# Altium schematic sheet ST_LINK.SchDoc
size A3; SheetNumber: 1; SheetTotal: 1
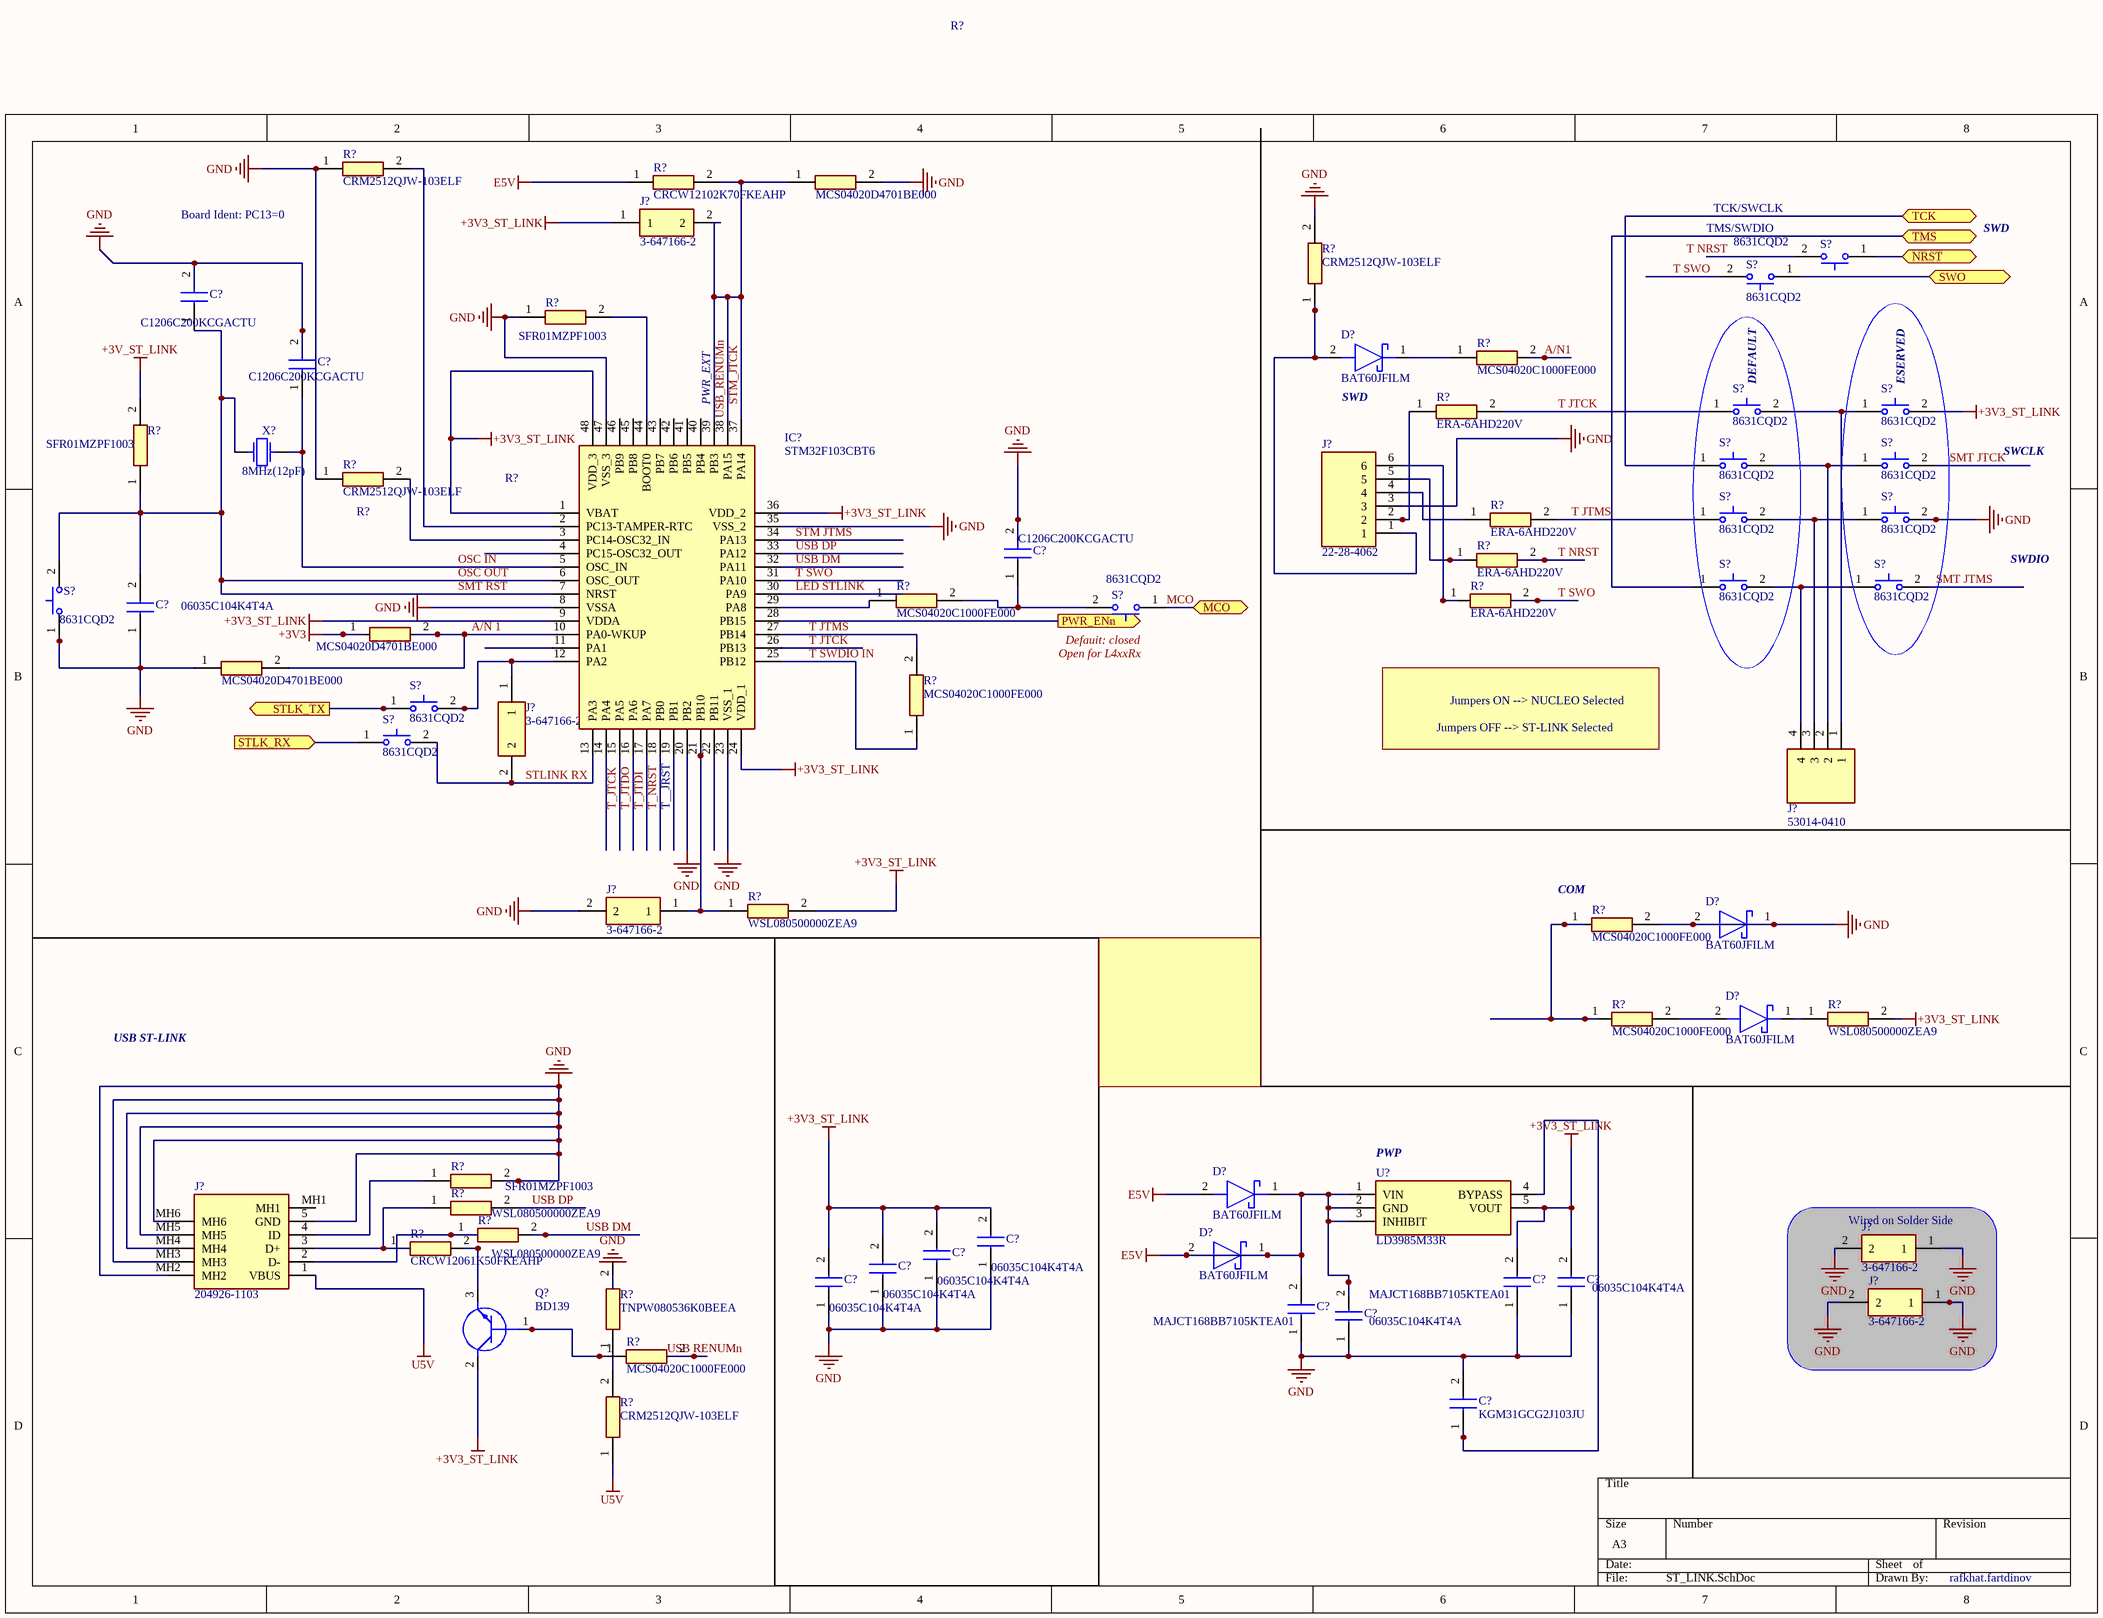
[diagram p0: ST_LINK.SchDoc]

## Parts
(Parts that share a designator on the sheet are numbered #1, #2 ... from top to bottom, then left to right.)
C?#1  C1206C200KCGACTU  [C1206]
C?#2  C1206C200KCGACTU  [C1206]
C?#3  C1206C200KCGACTU  [C1206]
C?#4  06035C104K4T4A  [CAPC1608X90N]
C?#5  06035C104K4T4A  [CAPC1608X90N]
C?#6  06035C104K4T4A  [CAPC1608X90N]
C?#7  06035C104K4T4A  [CAPC1608X90N]
C?#8  06035C104K4T4A  [CAPC1608X90N]
C?#9  MAJCT168BB7105KTEA01  [MAJx16]
C?#10  06035C104K4T4A  [CAPC1608X90N]
C?#11  MAJCT168BB7105KTEA01  [MAJx16]
C?#12  06035C104K4T4A  [CAPC1608X90N]
C?#13  KGM31GCG2J103JU  [CAPC3316X145N]
D?#1  BAT60JFILM  [SOD2513X117N]
D?#2  BAT60JFILM  [SOD2513X117N]
D?#3  BAT60JFILM  [SOD2513X117N]
D?#4  BAT60JFILM  [SOD2513X117N]
D?#5  BAT60JFILM  [SOD2513X117N]
IC?  STM32F103CBT6  [QFP50P900X900X160-48N]
J?#1  3-647166-2  [36471662]
J?#2  22-28-4062  [HDRV6W66P0X254_1X6_1524X249X838P]
J?#3  53014-0410  [SHDR4W60P0X200_1X4_1200X435X1000P]
J?#4  3-647166-2  [36471662]
J?#5  3-647166-2  [36471662]
J?#6  3-647166-2  [36471662]
J?#7  204926-1103  [2049261103]
J?#8  3-647166-2  [36471662]
Q?  BD139  [TO254P290X760X1320-3P]
R?#1  CRM2512QJW-103ELF  [RESC6331X80N]
R?#2  CRCW12102K70FKEAHP  [RESC3225X70N]
R?#3  MCS04020D4701BE000  [RESC1005X37N]
R?#4  CRM2512QJW-103ELF  [RESC6331X80N]
R?#5  SFR01MZPF1003  [RESC1005X40N]
R?#6  MCS04020C1000FE000  [RESC1005X37N]
R?#7  ERA-6AHD220V  [ERA6AEB1020V]
R?#8  CRM2512QJW-103ELF  [RESC6331X80N]
R?#9  SFR01MZPF1003  [RESC1005X40N]
R?#10  ERA-6AHD220V  [ERA6AEB1020V]
R?#11  ERA-6AHD220V  [ERA6AEB1020V]
R?#12  MCS04020C1000FE000  [RESC1005X37N]
R?#13  ERA-6AHD220V  [ERA6AEB1020V]
R?#14  MCS04020D4701BE000  [RESC1005X37N]
R?#15  MCS04020D4701BE000  [RESC1005X37N]
R?#16  MCS04020C1000FE000  [RESC1005X37N]
R?#17  WSL080500000ZEA9  [RESC2013X84N]
R?#18  MCS04020C1000FE000  [RESC1005X37N]
R?#19  MCS04020C1000FE000  [RESC1005X37N]
R?#20  WSL080500000ZEA9  [RESC2013X84N]
R?#21  SFR01MZPF1003  [RESC1005X40N]
R?#22  WSL080500000ZEA9  [RESC2013X84N]
R?#23  WSL080500000ZEA9  [RESC2013X84N]
R?#24  CRCW12061K50FKEAHP  [RESC3116X65N]
R?#25  MCS04020C1000FE000  [RESC1005X37N]
R?#26  TNPW080536K0BEEA  [RESC2012X55N]
R?#27  CRM2512QJW-103ELF  [RESC6331X80N]
S?#1  8631CQD2  [8631CQD2]
S?#2  8631CQD2  [8631CQD2]
S?#3  8631CQD2  [8631CQD2]
S?#4  8631CQD2  [8631CQD2]
S?#5  8631CQD2  [8631CQD2]
S?#6  8631CQD2  [8631CQD2]
S?#7  8631CQD2  [8631CQD2]
S?#8  8631CQD2  [8631CQD2]
S?#9  8631CQD2  [8631CQD2]
S?#10  8631CQD2  [8631CQD2]
S?#11  8631CQD2  [8631CQD2]
S?#12  8631CQD2  [8631CQD2]
S?#13  8631CQD2  [8631CQD2]
S?#14  8631CQD2  [8631CQD2]
U?  LD3985M33R  [SOT95P280X145-5N]
X?  F0: 8MHz(12pF)  (hidden comment: Crystal)

## Blocks framed on the sheet
Wired on Solder Side: J?#6 J?#8

## Ports
MCO (bidir), NRST (bidir), PWR_ENn (out), STLK_RX (in), STLK_TX (out), SWO (bidir), TCK (bidir), TMS (bidir)

## Nets
+3V3: R?#14.1
+3V3_ST_LINK: C?#5.2 C?#6.2 C?#7.2 C?#8.2 C?#9.2 C?#10.2 IC?.1(VBAT) IC?.9(VDDA) IC?.24(VDD_1) IC?.36(VDD_2) IC?.48(VDD_3) J?#1.1 Q?.2(C) R?#17.2 R?#20.2 S?#4.2(N.O._2) U?.5(VOUT)
+3V_ST_LINK: R?#9.2
E5V: C?#11.2 C?#12.2 D?#4.1(K) D?#4.2(A) D?#5.1(K) D?#5.2(A) R?#2.1 U?.1(VIN) U?.2(GND) U?.3(INHIBIT)
GND: C?#1.2 C?#2.2 C?#3.2 C?#4.1 C?#5.1 C?#6.1 C?#7.1 C?#8.1 C?#9.1 C?#10.1 C?#11.1 C?#12.1 C?#13.2 D?#2.1(K) D?#2.2(A) IC?.8(VSSA) IC?.20(PB2) IC?.23(VSS_1) IC?.35(VSS_2) IC?.47(VSS_3) J?#2.3 J?#5.2 J?#6.1 J?#6.2 J?#7.5(GND) J?#7.MH2 J?#7.MH3 J?#7.MH4 J?#7.MH5 J?#7.MH6 J?#8.1 J?#8.2 R?#1.1 R?#3.2 R?#4.2 R?#5.1 R?#8.1 R?#15.1 R?#18.2 R?#21.2 S?#8.2(N.O._2) S?#12.1(N.O._1)
U5V: J?#7.1(VBUS) R?#27.1
MCO: S?#11.1(N.O._1) ; port MCO
NRST: S?#1.1(N.O._1) ; port NRST
PWR_ENn: IC?.28(PB15) ; port PWR_ENn
STLK_RX: S?#14.1(N.O._1) ; port STLK_RX
STLK_TX: S?#13.1(N.O._1) ; port STLK_TX
SWO: S?#2.1(N.O._1) ; port SWO
TCK: S?#5.1(N.O._1) ; port TCK
TMS: S?#9.1(N.O._1) ; port TMS
USB DM: R?#23.2
USB DP: R?#22.2
USB RENUMn: R?#25.2
NetC?#1_1: C?#1.1 C?#4.2 IC?.6(OSC_OUT) IC?.7(NRST) R?#9.1 S?#12.2(N.O._2) X?.1
NetC?#2_1: C?#2.1 IC?.5(OSC_IN) X?.2
NetC?#3_1: C?#3.1 R?#12.2 S?#11.2(N.O._2)
NetC?#13_1: C?#13.1 U?.4(BYPASS)
NetD?#1_1: D?#1.1(K) R?#6.1
NetD?#1_2: D?#1.2(A) J?#2.1 R?#4.1
NetD?#3_1: D?#3.1(K) R?#20.1
NetD?#3_2: D?#3.2(A) R?#19.2
NetIC?_2: IC?.2(PC13-TAMPER-RTC) R?#1.2
NetIC?_3: IC?.3(PC14-OSC32_IN) R?#8.2
NetIC?_10: IC?.10(PA0-WKUP) R?#14.2 R?#15.2
NetIC?_12: IC?.12(PA2) J?#4.1 S?#13.2(N.O._2)
NetIC?_13: IC?.13(PA3) J?#4.2 S?#14.2(N.O._2)
NetIC?_21: IC?.21(PB10) J?#5.1 R?#17.1
NetIC?_25: IC?.25(PB12) R?#16.1
NetIC?_27: IC?.27(PB14) R?#16.2
NetIC?_29: IC?.29(PA8) R?#12.1
NetIC?_37: IC?.37(PA14) IC?.38(PA15) IC?.39(PB3) J?#1.2 R?#2.2 R?#3.1
NetIC?_44: IC?.44(BOOT0) R?#5.2
NetJ?#2_2: J?#2.2 R?#7.1
NetJ?#2_4: J?#2.4 R?#10.1
NetJ?#2_5: J?#2.5 R?#11.1
NetJ?#2_6: J?#2.6 R?#13.1
NetJ?#3_1: J?#3.1 S?#3.2(N.O._2) S?#4.1(N.O._1)
NetJ?#3_2: J?#3.2 S?#5.2(N.O._2) S?#6.1(N.O._1)
NetJ?#3_3: J?#3.3 S?#7.2(N.O._2) S?#8.1(N.O._1)
NetJ?#3_4: J?#3.4 S?#9.2(N.O._2) S?#10.1(N.O._1)
NetJ?#7_2: J?#7.2(D-) R?#23.1
NetJ?#7_3: J?#7.3(D+) R?#22.1 R?#24.1
NetJ?#7_4: J?#7.4(ID) R?#21.1
NetQ?_1: Q?.1(B) R?#25.1
NetQ?_3: Q?.3(E) R?#24.2
NetR?#7_2: R?#7.2 S?#3.1(N.O._1)
NetR?#10_2: R?#10.2 S?#7.1(N.O._1)
NetR?#18_1: R?#18.1 R?#19.1
NetR?#26_1: R?#26.1 R?#27.2

Not connected (* = marked no-connect by the designer): IC? 4(PC15-OSC32_OUT) 11(PA1) 14(PA4) 15(PA5) 16(PA6) 17(PA7) 18(PB0) 19(PB1) 22(PB11) 26(PB13) 30(PA9) 31(PA10) 32(PA11) 33(PA12) 34(PA13) 40(PB4) 41(PB5) 42(PB6) 43(PB7) 45(PB8) 46(PB9); J?#7 MH1; R?#6 2; R?#11 2; R?#13 2; R?#26 2; S?#1 2(N.O._2); S?#2 2(N.O._2); S?#6 2(N.O._2); S?#10 2(N.O._2)

## Notes on the sheet
- Board Ident: PC13=0
- TCK/SWCLK
- (near S?#2) T SWO
- (near S?#2) T NRST
- (near S?#2) TMS/SWDIO
- SWD
- (near R?#6) A/N1
- (near IC?) PWR_EXT
- (near IC?) USB_RENUMn
- (near IC?) STM_JTCK
- (near D?#1) SWD
- T JTCK
- (near S?#3) DEFAULT
- (near S?#4) ESERVED
- (near S?#6) SMT JTCK
- SWCLK
- OSC IN
- (near IC?) STM JTMS
- (near IC?) USB DP
- (near IC?) USB DM
- (near R?#10) T NRST
- (near R?#10) T JTMS
- SWDIO
- SMT RST
- OSC OUT
- (near IC?) T SWO
- LED STLINK
- (near S?#11) MCO
- (near R?#13) T SWO
- (near S?#10) SMT JTMS
- A/N 1
- T JTMS
- T SWDIO IN
- (near S?#11) Open for L4xxRx
- (near S?#11) Defauit: closed
- Jumpers OFF --> ST-LINK Selected
- Jumpers ON --> NUCLEO Selected
- (near J?#4) STLINK RX
- (near IC?) T_JTCK
- (near IC?) T_JTDO
- (near IC?) T_JTDI
- (near IC?) T_NRST
- (near IC?) T__JRST
- (near R?#18) COM
- USB ST-LINK
- (near U?) PWP
- rafkhat.fartdinov

## Library data of the parts
C?#1-C?#3 = C1206C200KCGACTU: Capacitor; Manufacturer_Name: KEMET; Datasheet Link: https://content.kemet.com/datasheets/KEM_C1009_C0G_HV_SMD.pdf; Manufacturer_Part_Number: C1206C200KCGACTU
C?#4-C?#8 C?#10 C?#12 = 06035C104K4T4A: Capacitor; Manufacturer_Name: Kyocera AVX; Datasheet Link: https://componentsearchengine.com/Datasheets/1/06031A100FAT2A.pdf; Height: 0.9mm; Manufacturer_Part_Number: 06035C104K4T4A; Mouser Part Number: 581-06035C104K4T4A; Mouser Price/Stock: https://www.mouser.co.uk/ProductDetail/KYOCERA-AVX/06035C104K4T4A?qs=NBj5Hwer2CEXBYKT%252BbuSBA%3D%3D; Arrow Part Number: 06035C104K4T4A; Arrow Price/Stock: https://www.arrow.com/en/products/06035c104k4t4a/avx
C?#9 C?#11 = MAJCT168BB7105KTEA01: Capacitor; Manufacturer_Name: TAIYO YUDEN; Datasheet Link: https://ds.yuden.co.jp/TYCOMPAS/or/detail?pn=MAJCT168BB7105KTEA01; Height: 0.8mm; Manufacturer_Part_Number: MAJCT168BB7105KTEA01
C?#13 = KGM31GCG2J103JU: Capacitor; Manufacturer_Name: Kyocera AVX; Datasheet Link: https://datasheets.kyocera-avx.com/HVKGM.pdf; Height: 1.45mm; Manufacturer_Part_Number: KGM31GCG2J103JU; Mouser Part Number: 581-KGM31GCG2J103JU; Mouser Price/Stock: https://www.mouser.co.uk/ProductDetail/KYOCERA-AVX/KGM31GCG2J103JU?qs=63Lh8XYXgjt6ivbLeGkCxg%3D%3D
D?#1-D?#5 = BAT60JFILM: Schottky Diode; Manufacturer_Name: STMicroelectronics; Datasheet Link: https://www.mouser.jp/datasheet/2/389/cd00001944-1795661.pdf; Height: 1.17mm; Manufacturer_Part_Number: BAT60JFILM; Mouser Part Number: 511-BAT60JFILM; Mouser Price/Stock: https://www.mouser.co.uk/ProductDetail/STMicroelectronics/BAT60JFILM?qs=GnFZssByvVVVnMaukcyLZg%3D%3D; Arrow Part Number: BAT60JFILM; Arrow Price/Stock: https://www.arrow.com/en/products/bat60jfilm/stmicroelectronics?region=nac
IC? = STM32F103CBT6: Integrated Circuit; Manufacturer_Name: STMicroelectronics; Datasheet Link: http://www.st.com/st-web-ui/static/active/en/resource/technical/document/datasheet/CD00161566.pdf; Height: 1.6mm; Manufacturer_Part_Number: STM32F103CBT6; Mouser Part Number: 511-STM32F103CBT6; Mouser Price/Stock: https://www.mouser.co.uk/ProductDetail/STMicroelectronics/STM32F103CBT6?qs=WxFF5lh7QM3goh6GV5Ogig%3D%3D; Arrow Part Number: STM32F103CBT6; Arrow Price/Stock: https://www.arrow.com/en/products/stm32f103cbt6/stmicroelectronics?region=europe
J?#1 J?#4-J?#6 J?#8 = 3-647166-2: Connector; Manufacturer_Name: TE Connectivity; Datasheet Link: https://www.te.com/commerce/DocumentDelivery/DDEController?Action=showdoc&DocId=Customer+Drawing%7F647166%7FR1%7Fpdf%7FEnglish%7FENG_CD_647166_R1.pdf%7F3-647166-2; Height: 10.66mm; Manufacturer_Part_Number: 3-647166-2; Mouser Part Number: 571-3-647166-2; Mouser Price/Stock: https://www.mouser.co.uk/ProductDetail/TE-Connectivity/3-647166-2?qs=xsTFCgGnzbJU1qz6Np9kzA%3D%3D; Arrow Part Number: 3-647166-2; Arrow Price/Stock: https://www.arrow.com/en/products/3-647166-2/te-connectivity?region=nac
J?#2 = 22-28-4062: Connector; Manufacturer_Name: Molex; Datasheet Link: https://datasheet.datasheetarchive.com/originals/distributors/SFDatasheet-1/sf-00031037.pdf; Height: 8.38mm; Manufacturer_Part_Number: 22-28-4062; Mouser Part Number: 538-22-28-4062; Mouser Price/Stock: https://www.mouser.com/Search/Refine.aspx?Keyword=538-22-28-4062
J?#3 = 53014-0410: Connector; Manufacturer_Name: Molex; Datasheet Link: https://www.molex.com/pdm_docs/sd/530140410_sd.pdf; Height: 10mm; Manufacturer_Part_Number: 53014-0410; Mouser Part Number: 538-53014-0410; Mouser Price/Stock: https://www.mouser.co.uk/ProductDetail/Molex/53014-0410?qs=TLs3Kb%252BkMqKk8s1WRHwRGw%3D%3D
J?#7 = 204926-1103: Connector; Manufacturer_Name: Molex; Datasheet Link: https://www.molex.com/content/dam/molex/molex-dot-com/products/automated/en-us/salesdrawingpdf/204/204926/2049261103_sd.pdf; Height: 4.65mm; Manufacturer_Part_Number: 204926-1103; Mouser Part Number: 538-204926-1103; Mouser Price/Stock: https://www.mouser.co.uk/ProductDetail/Molex/204926-1103?qs=55YtniHzbhBOQihiQOeiLg%3D%3D; Arrow Part Number: 204926-1103; Arrow Price/Stock: https://www.arrow.com/en/products/204926-1103/molex?region=nac
Q? = BD139: Transistor BJT NPN; Manufacturer_Name: STMicroelectronics; Datasheet Link: http://www.st.com/web/en/resource/technical/document/datasheet/CD00001225.pdf; Height: 2.9mm; Manufacturer_Part_Number: BD139; Mouser Part Number: 511-BD139; Mouser Price/Stock: https://www.mouser.co.uk/ProductDetail/STMicroelectronics/BD139?qs=ljbEvF4DwOPW%2FLxHSWYMMA%3D%3D; Arrow Part Number: BD139; Arrow Price/Stock: https://www.arrow.com/en/products/bd139/stmicroelectronics?region=europe
R?#1 R?#4 R?#8 R?#27 = CRM2512QJW-103ELF: Resistor; Manufacturer_Name: Bourns; Datasheet Link: http://www.bourns.com/data/global/pdfs/CRM0805_1206_2010.pdf; Height: 0.8mm; Manufacturer_Part_Number: CRM2512QJW-103ELF; Mouser Part Number: 652-CRM2512QJW-103E; Mouser Price/Stock: https://www.mouser.co.uk/ProductDetail/Bourns/CRM2512QJW-103ELF?qs=8Wlm6%252BaMh8Rzg3bRHdWGsA%3D%3D; Arrow Part Number: CRM2512QJW-103ELF; Arrow Price/Stock: https://www.arrow.com/en/products/crm2512qjw-103elf/bourns?region=nac
R?#2 = CRCW12102K70FKEAHP: Resistor; Manufacturer_Name: Vishay; Datasheet Link: http://componentsearchengine.com/Datasheets/1/CRCW12102K70FKEAHP.pdf; Height: 0.7mm; Manufacturer_Part_Number: CRCW12102K70FKEAHP; Mouser Part Number: 71-CRCW12102K70FKEAH; Mouser Price/Stock: https://www.mouser.co.uk/ProductDetail/Vishay-Dale/CRCW12102K70FKEAHP?qs=OAzHGkhREL0m0%252BU1n6AaAg%3D%3D
R?#3 R?#14 R?#15 = MCS04020D4701BE000: Resistor; Manufacturer_Name: Vishay; Datasheet Link: http://www.vishay.com/docs/28705/mcx0x0xpro.pdf; Height: 0.37mm; Manufacturer_Part_Number: MCS04020D4701BE000; Mouser Part Number: 594-MCS04020D4701BE0; Mouser Price/Stock: https://www.mouser.co.uk/ProductDetail/Vishay-Beyschlag/MCS04020D4701BE000?qs=ft9OtscSA3%252BR0DpF5QqL2Q%3D%3D
R?#5 R?#9 R?#21 = SFR01MZPF1003: Resistor; Manufacturer_Name: ROHM Semiconductor; Datasheet Link: https://fscdn.rohm.com/en/products/databook/datasheet/passive/resistor/chip_resistor/sfr-e.pdf; Height: 0.4mm; Manufacturer_Part_Number: SFR01MZPF1003; Mouser Part Number: 755-SFR01MZPF1003; Mouser Price/Stock: https://www.mouser.co.uk/ProductDetail/ROHM-Semiconductor/SFR01MZPF1003?qs=Mv7BduZupUj2RFL5gMaKTg%3D%3D
R?#6 R?#12 R?#16 R?#18 R?#19 R?#25 = MCS04020C1000FE000: Resistor; Manufacturer_Name: Vishay; Datasheet Link: http://www.vishay.com/docs/28705/mcx0x0xpro.pdf; Height: 0.37mm; Manufacturer_Part_Number: MCS04020C1000FE000; Mouser Part Number: 594-MCS04020C1000FE0; Mouser Price/Stock: https://www.mouser.co.uk/ProductDetail/Vishay-Beyschlag/MCS04020C1000FE000?qs=7ZE6F4QMOBYkwvQlfbkT8w%3D%3D; Arrow Part Number: MCS04020C1000FE000; Arrow Price/Stock: https://www.arrow.com/en/products/mcs04020c1000fe000/vishay
R?#7 R?#10 R?#11 R?#13 = ERA-6AHD220V: Resistor; Manufacturer_Name: Panasonic; Datasheet Link: https://industrial.panasonic.com/cdbs/www-data/pdf/RDM0000/AOA0000C307.pdf; Height: 0.6mm; Manufacturer_Part_Number: ERA-6AHD220V; Mouser Part Number: 667-ERA-6AHD220V; Mouser Price/Stock: https://www.mouser.co.uk/ProductDetail/Panasonic/ERA-6AHD220V/?qs=MNPzkKEzRtQTWqg2JSKn2A%3D%3D
R?#17 R?#20 R?#22 R?#23 = WSL080500000ZEA9: Resistor; Manufacturer_Name: Vishay; Datasheet Link: https://ad.componentsearchengine.com/Datasheets/2/WSL080500000ZEA9.pdf; Height: 0.838mm; Manufacturer_Part_Number: WSL080500000ZEA9; Mouser Part Number: 71-WSL080500000ZEA9; Mouser Price/Stock: https://www.mouser.co.uk/ProductDetail/Vishay-Dale/WSL080500000ZEA9?qs=f1l5vAGoKgsImKS87N8TmQ%3D%3D; Arrow Part Number: WSL080500000ZEA9; Arrow Price/Stock: https://www.arrow.com/en/products/wsl080500000zea9/vishay?region=nac
R?#24 = CRCW12061K50FKEAHP: Resistor; Manufacturer_Name: Vishay; Datasheet Link: http://componentsearchengine.com/Datasheets/1/CRCW12061K50FKEAHP.pdf; Height: 0.65mm; Manufacturer_Part_Number: CRCW12061K50FKEAHP; Mouser Part Number: 71-CRCW12061K50FKEAH; Mouser Price/Stock: https://www.mouser.co.uk/ProductDetail/Vishay-Dale/CRCW12061K50FKEAHP?qs=k2%2FDWSARqgEwHXAQbL4aEg%3D%3D; Arrow Part Number: CRCW12061K50FKEAHP; Arrow Price/Stock: https://www.arrow.com/en/products/crcw12061k50fkeahp/vishay?region=nac
R?#26 = TNPW080536K0BEEA: Resistor; Manufacturer_Name: Vishay; Datasheet Link: https://www.vishay.com/docs/31006/tnpw.pdf; Height: 0.55mm; Manufacturer_Part_Number: TNPW080536K0BEEA
S?#1-S?#14 = 8631CQD2: Switch (2-Pin Push); Manufacturer_Name: C & K COMPONENTS; Datasheet Link: https://www.ckswitches.com/media/1396/8600.pdf; Height: 13.93mm; Manufacturer_Part_Number: 8631CQD2; Mouser Part Number: 611-8631-261; Mouser Price/Stock: https://www.mouser.co.uk/ProductDetail/CK/8631CQD2?qs=ktcBc77oICXe9iPhfEwnkA%3D%3D
U? = LD3985M33R: Integrated Circuit; Manufacturer_Name: STMicroelectronics; Datasheet Link: http://www.st.com/st-web-ui/static/active/en/resource/technical/document/datasheet/CD00003395.pdf; Height: 1.45mm; Manufacturer_Part_Number: LD3985M33R; Mouser Part Number: 511-LD3985M33R; Mouser Price/Stock: https://www.mouser.co.uk/ProductDetail/STMicroelectronics/LD3985M33R?qs=22WmWNTp1rrPOccVv4HZ7A%3D%3D; Arrow Part Number: LD3985M33R; Arrow Price/Stock: https://www.arrow.com/en/products/ld3985m33r/stmicroelectronics?region=europe
X? = Crystal: R: 500; Q: 50K; SimulationGenericComponent: True